# Altium schematic sheet vdc_signal_adaptation.SchDoc
size A4; SheetNumber: 11; SheetTotal: 12
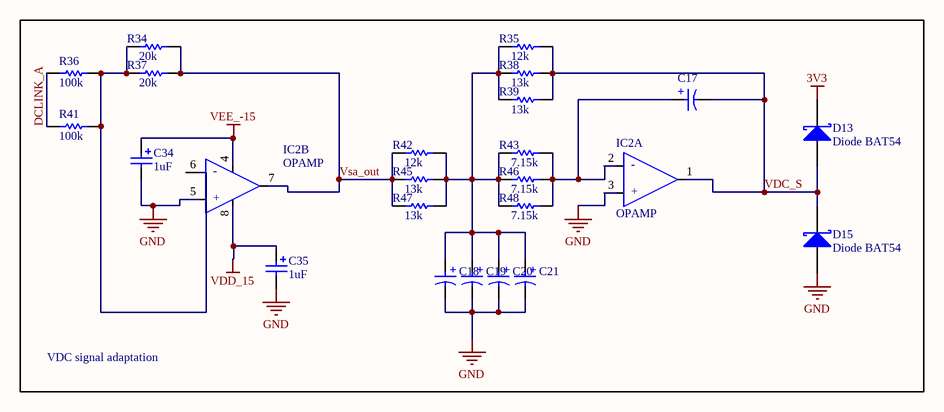
[diagram p0: vdc_signal_adaptation.SchDoc]

## Parts
C17  860020772005  [WCAP-ATG5_D5H11]  (value not drawn)
C18  860020772005  [WCAP-ATG5_D5H11]  (value not drawn)
C19  860020772005  [WCAP-ATG5_D5H11]  (value not drawn)
C20  860020772005  [WCAP-ATG5_D5H11]  (value not drawn)
C21  860020772005  [WCAP-ATG5_D5H11]  (value not drawn)
C34  value 1uF  [RAD-0.1]  (hidden comment: Cap No Pol)
C35  value 1uF  [RAD-0.1]  (hidden comment: Cap No Pol)
D13  Diode BAT54  [DO-204AL]
D15  Diode BAT54  [DO-204AL]
IC2  OPAMP  [DIP-8]  (parts A,B of 2)
R34  value 20k  [AXIAL-0.4]  (hidden comment: Res1)
R35  value 12k  [AXIAL-0.4]  (hidden comment: Res1)
R36  value 100k  [AXIAL-0.4]
R37  value 20k  [AXIAL-0.4]  (hidden comment: Res1)
R38  value 13k  [AXIAL-0.4]  (hidden comment: Res1)
R39  value 13k  [AXIAL-0.4]  (hidden comment: Res1)
R41  value 100k  [AXIAL-0.4]  (hidden comment: Res1)
R42  value 12k  [AXIAL-0.4]  (hidden comment: Res1)
R43  value 7.15k  [AXIAL-0.4]  (hidden comment: Res1)
R45  value 13k  [AXIAL-0.4]  (hidden comment: Res1)
R46  value 7.15k  [AXIAL-0.4]  (hidden comment: Res1)
R47  value 13k  [AXIAL-0.4]  (hidden comment: Res1)
R48  value 7.15k  [AXIAL-0.4]  (hidden comment: Res1)

## Blocks framed on the sheet
VDC signal adaptation: C17-C21 C34 C35 D13 D15 IC2 R34-R39 R41-R43 R45-R48

## Nets
3V3: D13.2(K)
GND: C18.2(N) C19.2(N) C20.2(N) C21.2(N) C34.2 C35.2 D15.1(A) IC2.3(IN_A_+) IC2.5(IN_B_+)
VDD_15: C35.1 IC2.8(V+)
VEE_-15: C34.1 IC2.4(-V)
DCLINK_A: R36.1 R41.1
VDC_S: C17.2(N) D13.1(A) D15.2(K) IC2.1(OUT_A) R35.2 R38.2 R39.2
Vsa_out: IC2.7(OUT_B) R34.2 R37.2 R42.1 R45.1 R47.1
NetC17_1: C17.1(P) IC2.2(IN_A_-) R43.2 R46.2 R48.2
NetC18_1: C18.1(P) C19.1(P) C20.1(P) C21.1(P) R35.1 R38.1 R39.1 R42.2 R43.1 R45.2 R46.1 R47.2 R48.1
NetIC2_6: IC2.6(IN_B_-) R34.1 R36.2 R37.1 R41.2

## Notes on the sheet
- (in symbol ADTL082, part A) -; +
- (in symbol ADTL082, part B) -; +
- (in symbol CMP-03913-53914248-1) +

## Library data of the parts
C17-C21 = CMP-03913-53914248-1: 860020772005 Cap Aluminum Lytic 1uF 63V 20% (5 X 11mm) Radial 2mm 13mA 2000h 105C; Life (Hours): 2000hours; Capacitance: 1µF; Material: Aluminium; Leakage Current: 3µA; Polarity: Polar; Voltage Rating: 63V; Tolerance: 20%; REACH SVHC: Unknown; Case/Package: Radial; NexarPartId: 53914248; Length: 11mm; Packaging: Tape & Box (TB); Pitch: 2mm; Ripple Current: 13mA; Height: 11mm; Height - Seated (Max): 12.4968mm; Max Operating Temperature: 105°C; Mount: Through Hole; Diameter: 5mm; RoHS: Compliant; Voltage Rating (DC): 63V; Lead Pitch: 2.0066mm; Min Operating Temperature: -40°C
C34 C35 = Cap No Pol: Polarized Capacitor (Radial); Published: 8-Jun-2000; LatestRevisionDate: 17-Jul-2002; LatestRevisionNote: Re-released for DXP Platform.; PackageReference: RB7.6-15; Publisher: Altium Limited; PackageDescription: Polarized Capacitor (Radial); 2 Leads
D13 D15 = Diode 11DQ03: Schottky Rectifier; Published: 8-Jun-2000; LatestRevisionDate: 17-Jul-2002; LatestRevisionNote: Re-released for DXP Platform.; DatasheetVersion: Dec-1997; PackageReference: DO-204AL; Publisher: Altium Limited; PackageDescription: Diode, Axial; Body 5.2 x 2.7 mm (LxDia. max), Lead Dia. 0.86 mm (max); Code_JEDEC: DO-204-AL; ComponentLink1Description: Manufacturer Link; ComponentLink1URL: http://www.irf.com/; ComponentLink2Description: Datasheet; ComponentLink2URL: http://www.irf.com/product-info/datasheets/data/11dq03.pdf
IC2 = ADTL082
R34-R39 R41-R43 R45-R48 = Res1: Resistor; Published: 8-Jun-2000; LatestRevisionDate: 17-Jul-2002; LatestRevisionNote: Re-released for DXP Platform.; PackageReference: AXIAL-0.3; Publisher: Altium Limited; PackageDescription: Axial Device, Thru-Hole; 2 Leads; 0.3 in Pin Spacing